# EAGLE schematic pre_schematic_v3 (EAGLE 9.7.0)
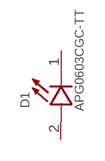
[diagram p0: schematic, sheet 1]

## Parts
D1  APG0603CGC-TT  [LED_APG0603CGC-TT]
Unconnected: D1.1(C) D1.2(A)

## Library data of the parts
D1 = APG0603CGC-TT:APG0603CGC-TT: Check availability <https://pricing.snapeda.com/parts/APG0603CGC-TT/Kingbright/view-part?ref=eda>; AVAILABILITY: In Stock; CHECK_PRICES: https://www.snapeda.com/parts/APG0603CGC-TT/Kingbright/view-part/?ref=eda; DESCRIPTION: Green 571nm LED Indication - Discrete 1.97V 2-SMD, 0201; MF: Kingbright; MP: APG0603CGC-TT; PACKAGE: 0201 Kingbright; PRICE: None; SNAPEDA_LINK: https://www.snapeda.com/parts/APG0603CGC-TT/Kingbright/view-part/?ref=snap